# Altium schematic sheet 4G_DTU.SchDoc
size A4
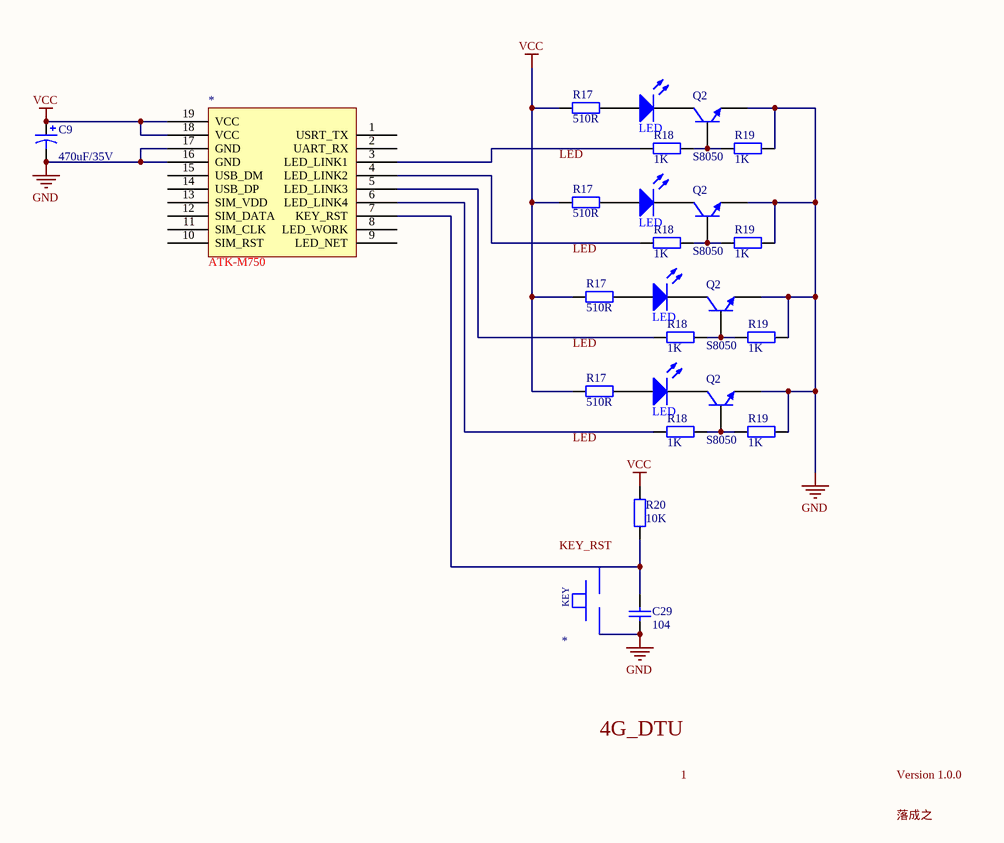
[diagram p0: 4G_DTU.SchDoc]

## Parts
(Parts that share a designator on the sheet are numbered #1, #2 ... from top to bottom, then left to right.)
*#1  Component_1  (value not drawn)
*#2  Component_1  (value not drawn)
C9  value 470uF/35V  [RB7.6-15]  (hidden comment: C9)
C29  value 104  [RAD-0.3]  (hidden comment: Cap)
DS?#1  LED  [LED-0]
DS?#2  LED  [LED-0]
DS?#3  LED  [LED-0]
DS?#4  LED  [LED-0]
Q2#1  S8050  [BCY-W3/E4]
Q2#2  S8050  [BCY-W3/E4]
Q2#3  S8050  [BCY-W3/E4]
Q2#4  S8050  [BCY-W3/E4]
R17#1  value 510R  [AXIAL-0.4]  (hidden comment: Res2)
R17#2  value 510R  [AXIAL-0.4]  (hidden comment: Res2)
R17#3  value 510R  [AXIAL-0.4]  (hidden comment: Res2)
R17#4  value 510R  [AXIAL-0.4]  (hidden comment: Res2)
R18#1  value 1K  [AXIAL-0.4]  (hidden comment: Res2)
R18#2  value 1K  [AXIAL-0.4]  (hidden comment: Res2)
R18#3  value 1K  [AXIAL-0.4]  (hidden comment: Res2)
R18#4  value 1K  [AXIAL-0.4]  (hidden comment: Res2)
R19#1  value 1K  [AXIAL-0.4]  (hidden comment: Res2)
R19#2  value 1K  [AXIAL-0.4]  (hidden comment: Res2)
R19#3  value 1K  [AXIAL-0.4]  (hidden comment: Res2)
R19#4  value 1K  [AXIAL-0.4]  (hidden comment: Res2)
R20  value 10K  [AXIAL-0.4]  (hidden comment: Res2)

## Nets
GND: *#1.16(GND) *#1.17(GND) C9.2 C29.1 Q2#1.1(E) Q2#2.1(E) Q2#3.1(E) Q2#4.1(E) R19#1.1 R19#2.1 R19#3.1 R19#4.1
VCC: *#1.18(VCC) *#1.19(VCC) C9.1 R17#1.2 R17#2.2 R17#3.2 R17#4.2 R20.2
Net*#1_3: *#1.3(LED_LINK1) R18#1.2
Net*#1_4: *#1.4(LED_LINK2) R18#2.2
Net*#1_5: *#1.5(LED_LINK3) R18#3.2
Net*#1_6: *#1.6(LED_LINK4) R18#4.2
Net*#1_7: *#1.7(KEY_RST) C29.2 R20.1
NetDS?#1_1: DS?#1.1(A) R17#1.1
NetDS?#2_1: DS?#2.1(A) R17#2.1
NetDS?#3_1: DS?#3.1(A) R17#3.1
NetDS?#4_1: DS?#4.1(A) R17#4.1
NetQ2#1_2: Q2#1.2(B) R18#1.1 R19#1.2
NetQ2#2_2: Q2#2.2(B) R18#2.1 R19#2.2
NetQ2#3_2: Q2#3.2(B) R18#3.1 R19#3.2
NetQ2#4_2: Q2#4.2(B) R18#4.1 R19#4.2

Not connected (* = marked no-connect by the designer): *#1 1(USRT_TX) 2(UART_RX) 8(LED_WORK) 9(LED_NET) 10(SIM_RST) 11(SIM_CLK) 12(SIM_DATA) 13(SIM_VDD) 14(USB_DP) 15(USB_DM); DS?#1 2(K); DS?#2 2(K); DS?#3 2(K); DS?#4 2(K); Q2#1 3(C); Q2#2 3(C); Q2#3 3(C); Q2#4 3(C)

## Notes on the sheet
- Labels drawn without touching a wire or pin: 1, 4G_DTU, KEY_RST, LED, Version 1.0.0, 落成之
- (in symbol Component_1) KEY; ATK-M750

## Library data of the parts
C9 = Cap Pol1: Polarized Capacitor (Radial); Published: 8-Jun-2000; LatestRevisionDate: 17-Jul-2002; LatestRevisionNote: Re-released for DXP Platform.; PackageReference: RB7.6-15; Publisher: Altium Limited; PackageDescription: Polarized Capacitor (Radial); 2 Leads
C29 = Cap: Capacitor; Published: 8-Jun-2000; LatestRevisionDate: 17-Jul-2002; LatestRevisionNote: Re-released for DXP Platform.; PackageReference: RAD-0.3; Publisher: Altium Limited; PackageDescription: Radial Cap, Thru-Hole; 2 Leads; 0.3 in Pin Spacing
DS?#1-DS?#4 = LED0: Typical INFRARED GaAs LED; Published: 8-Jun-2000; LatestRevisionDate: 17-Jul-2002; LatestRevisionNote: Re-released for DXP Platform.; Publisher: Altium Limited
Q2#1-Q2#4 = 2N3904: NPN General Purpose Amplifier; Published: 8-Jun-2000; LatestRevisionDate: 15-Jan-2003; LatestRevisionNote: PCB Footprint 'BCY-W3/D4.7' replaced; DatasheetDocument: 1997; PackageReference: TO-92A; Publisher: Altium Limited; Code_JEDEC: TO-92A
R17#1-R17#4 R18#1-R18#4 R19#1-R19#4 R20 = Res2: Resistor; Published: 8-Jun-2000; LatestRevisionDate: 17-Jul-2002; LatestRevisionNote: Re-released for DXP Platform.; PackageReference: AXIAL-0.4; Publisher: Altium Limited; PackageDescription: Axial Device, Thru-Hole; 2 Leads; 0.4 in Pin Spacing